# EAGLE schematic pv emulator (EAGLE 7.5.0)
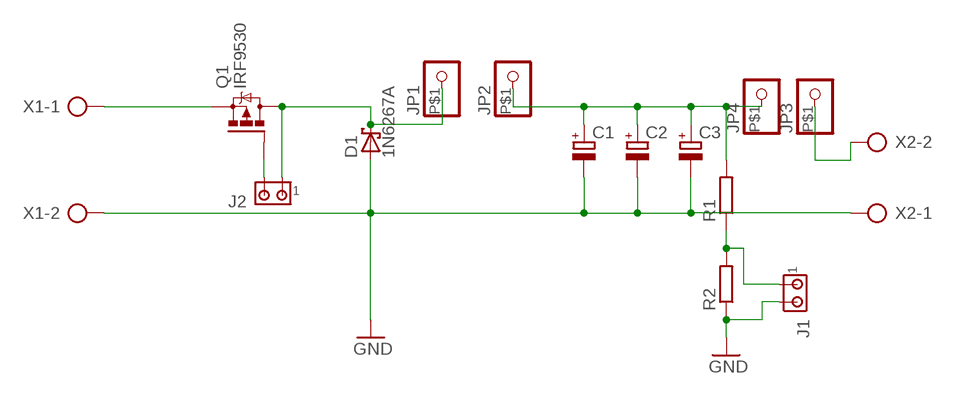
[diagram p0: schematic, sheet 1]

## Parts
C1  CPOL-EUE5-10.5  [E5-10,5]
C2  CPOL-EUE5-10.5  [E5-10,5]
C3  CPOL-EUE5-10.5  [E5-10,5]
D1  1N6267A  [C4111-15]
J1  MTA02-100  [10X02MTA]
J2  MTA02-100  [10X02MTA]
JP1  PINHD-1X1-BIGPOGO  [1X1-BIGPOGO]
JP2  PINHD-1X1-BIGPOGO  [1X1-BIGPOGO]
JP3  PINHD-1X1-BIGPOGO  [1X1-BIGPOGO]
JP4  PINHD-1X1-BIGPOGO  [1X1-BIGPOGO]
Q1  IRF9530  [TO220BV]
R1  R-EU_0204/7  [0204/7]
R2  R-EU_0204/7  [0204/7]
X1  AK300/2  [AK300/2]
X2  AK300/2  [AK300/2]

## Nets
GND: C1.- C2.- C3.- D1.A J1.2 R2.1 X1.2 X2.1
N$1: Q1.S X1.1
N$2: D1.C J2.1 JP1.P$1 Q1.D
N$4: C1.+ C2.+ C3.+ JP2.P$1 JP4.P$1 R1.2
N$6: JP3.P$1 X2.2
N$7: J1.1 R1.1 R2.2
N$10: J2.2 Q1.G

## Library data of the parts
C1-C3 = resistor:CPOL-EU: POLARIZED CAPACITOR, European symbol
D1 = diode:1N6267A: DIODE transient voltage suppressor
J1 J2 = con-amp:MTA02-100: AMP connector
JP1-JP4 = adafruit:PINHD-1X1: Pin header 1x1 for 0.1" spacing With round pins
Q1 = transistor-power:IRF9530: P-CHANNEL HEXFET POWER-MOS-FET Source: http://www.irf.com/product-info/datasheets/data/irf9530.pdf
R1 R2 = rcl:R-EU_: RESISTOR, European symbol
X1 X2 = con-ptr500:AK300/2: CONNECTOR; OC_FARNELL: unknown; OC_NEWARK: unknown